# EAGLE design TPS61169_HPLED (EAGLE 6.5.0)
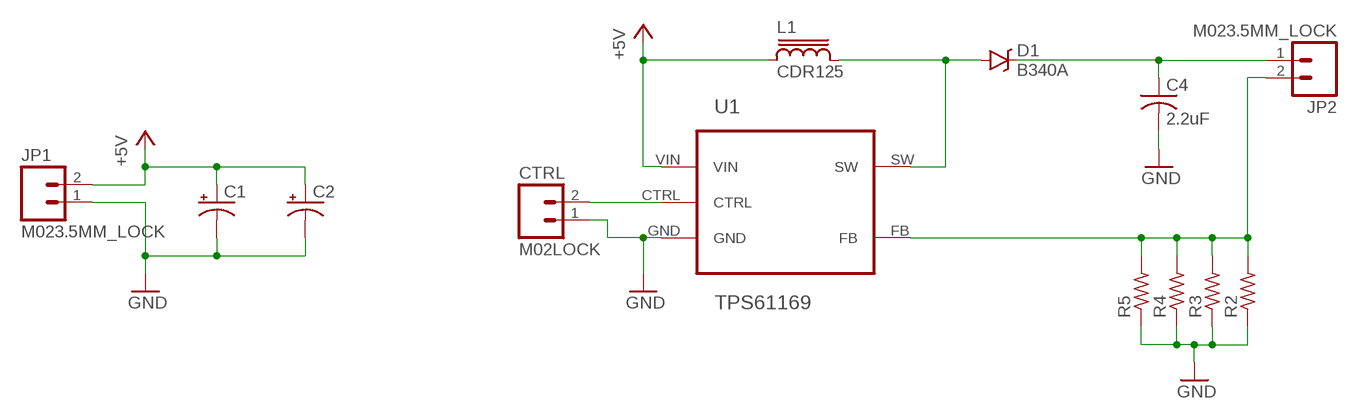
[diagram p0: schematic, sheet 1]

## Parts
C1  CPOL-USE3.5-8  [E3,5-8]
C2  CPOL-USE3.5-8  [E3,5-8]
C4  2.2uF  C-USC0805  [C0805]
CTRL  M02LOCK  [1X02_LOCK]
D1  B340A  DIODE-SCHOTTKY-B340A  [SMA-DIODE]
JP1  M023.5MM_LOCK  [SCREWTERMINAL-3.5MM-2_LOCK]
JP2  M023.5MM_LOCK  [SCREWTERMINAL-3.5MM-2_LOCK]
L1  CDR125  [CDR125]
R2  R-US_R0805  [R0805]
R3  R-US_R0805  [R0805]
R4  R-US_R0805  [R0805]
R5  R-US_R0805  [R0805]
U1  TPS61169  74AHCT1G04GW/T1  [SOT65P210X110-5N]

## Nets
+5V: C1.+ C2.+ JP1.2 L1.1 U1.VIN
GND: C1.- C2.- C4.2 CTRL.1 JP1.1 R2.1 R3.1 R4.1 R5.1 U1.GND
N$1: CTRL.2 U1.CTRL
N$2: D1.A L1.2 U1.SW
N$3: JP2.2 R2.2 R3.2 R4.2 R5.2 U1.FB
N$4: C4.1 D1.C JP2.1

## Library data of the parts
C1 C2 = rcl:CPOL-US: POLARIZED CAPACITOR, American symbol
C4 = rcl:C-US: CAPACITOR, American symbol
CTRL JP1 JP2 = SparkFun-Connectors:M02: Standard 2-pin 0.1" header. Use with - straight break away headers ( PRT-00116) - right angle break away headers (PRT-00553) - swiss pins (PRT-00743) - machine pins (PRT-00117) - female headers (PRT-00115) Molex polarized connector foot print use with: PRT-08233 with associated crimp pins and housings. 2.54_SCREWTERM for use with PRT-10571. 3.5mm Screw Terminal footprints for PRT-08084 5mm Screw Terminal footprints for use with PRT-08432
D1 = SparkFun-DiscreteSemi:DIODE-SCHOTTKY: Schottky diodes in SFE's production catalog BAT20J 1A 23V 0.62Vf RB751 120mA 40V 0.37Vf PMEG4005EJ 0.5A 40V 0.42Vf MBRA140 1A 40V 0.5Vf B340A 3A 40V SMA; PROD_ID: DIO-09886
L1 = inductor-sumida:CDR125: Power Inductor
R2-R5 = rcl:R-US_: RESISTOR, American symbol
U1 = TPS61169:74AHCT1G04GW/T1: Inverter; MPN: 74AHCT1G04GW/T1; OC_FARNELL: 1085245; OC_NEWARK: 99K0509; PACKAGE: SOT353-1-5; SUPPLIER: NXP

## Board
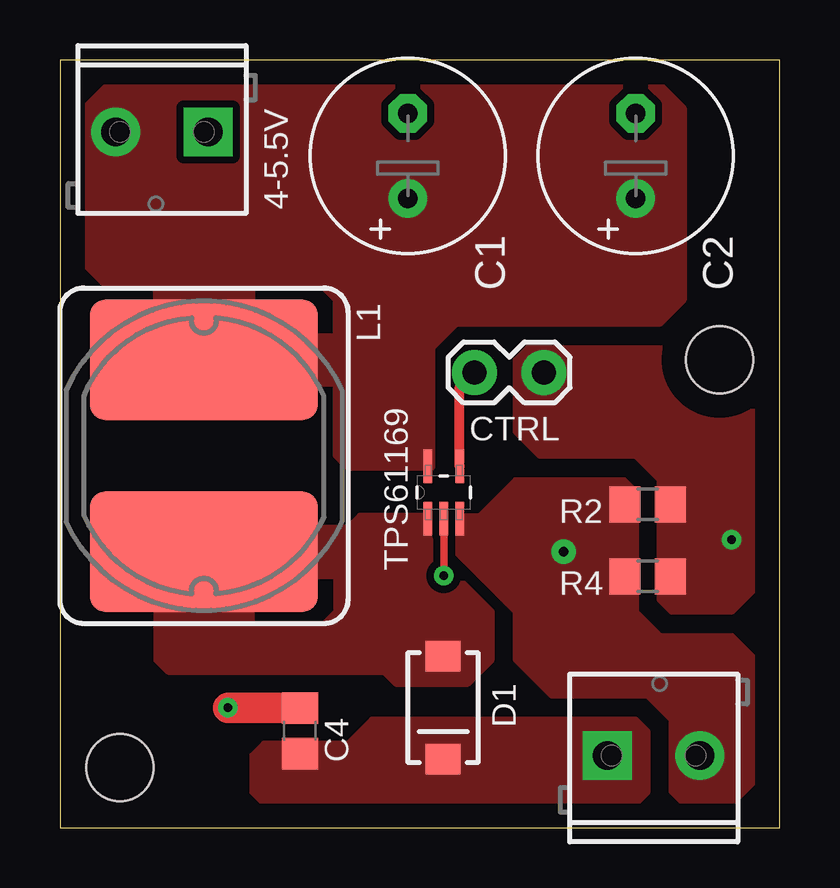
[diagram p1: board, top side]
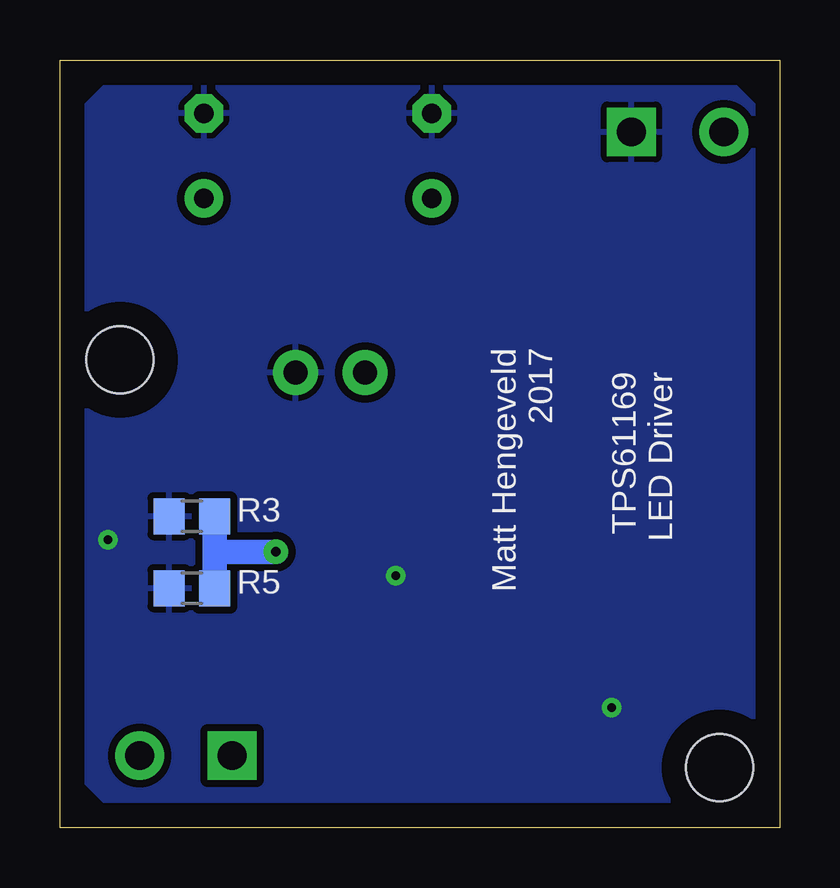
[diagram p2: board, bottom side, seen from below]

Size 30 x 32 mm. Coordinates in mm from the lower left corner, seen from the top.
Outline: 0,0 30,0 30,32 0,32 0,0
Copper layers (1*16): Top 0.035mm / dielectric 1.5mm / Bottom 0.035mm
Design rules "default *": minimum track width 10mil, minimum drill 24mil, track to track 8mil, track to pad 8mil, pad to pad 8mil, via to via 8mil, smd to smd 8mil, copper to edge 40mil, drill to drill 8mil, minimum pad ring 10mil, minimum via ring 8mil, stop-mask expansion 4mil, vias tented up to drill 0mil, thermal gap 10mil
Holes 2.8 mm at 2.5,2.5 27.5,19.5

### Footprints (pad centres in the part's own frame; a part is rotated, then mirrored left to right if it is on the bottom)
E3,5-8 = drill 0.813 pad 1.6: + -1.778,0 | drill 0.813 pad 1.6 octagon: - 1.778,0
C0805 = smd 1.3 x 1.5: 1 -0.95,0; 2 0.95,0
1X02_LOCK = drill 1.016 pad 1.88: 1 -0.178,0; 2 2.718,0
SMA-DIODE = smd 1.27 x 1.47: A -2.15,0; C 2.15,0
SCREWTERMINAL-3.5MM-2_LOCK = drill 1.2 pad 2.032 square: 1 -0.178,0 | drill 1.2 pad 2.032: 2 3.678,0
CDR125 = smd 5 x 9.5: 1 -4,0; 2 4,0
R0805 = smd 1.3 x 1.5: 1 -0.95,0; 2 0.95,0
SOT65P210X110-5N = smd 1.397 x 0.356: CTRL 1.092,-0.66; FB -1.092,-0.66; GND -1.092,0; SW -1.092,0.66; VIN 1.092,0.66

### Placement (x,y rotation side)
C1  14.5,28 90 top
C2  24,28 90 top
C4  10,4.03 90 top
CTRL  20,18.97 180 top
D1  15.97,5 270 top
JP1  6,29 180 top
JP2  23,3 0 top
L1  6,15.5 270 top
R2  24.5,13.47 180 top
R3  24.5,12.97 0 bottom
R4  24.5,10.47 180 top
R5  24.5,9.97 0 bottom
U1  16,13.97 90 top

### Tracks (layer width: path | path; a pad name or v marks a point on that pad's centre or on a via)
+5V
  pour Top (isolate 0.305, no thermals): 2,31 25,31 26,30 26,22 25,21 16.5,21 15.5,20 15.5,15 12,15 11.5,15.5 11.5,18.5 10.5,18.5 10.5,20.5 11.5,20.5 11.5,22 11,22.5 8,22.5 8,21.5 4,21.5 4,22.5 2,22.5 1,23.5 1,30
GND  (via drill 0.35 pad 0.81)
  Top 0.305: U1.GND v16,10.5
  Top 1.27: C4.2 7,4.98 v7,5
  other vias: 28,12
  pour Bottom (isolate 0.305): 28,31 2,31 1,30 1,4 4,1 28,1 29,2 29,30
  pour Top (isolate 0.305, no thermals): 29,10 28,9 25.5,9 25,9.5 25,14.5 24,15.5 20,15.5 19,16.5 19,19.5 19.5,20 28,20 29,19
N$1
  Top 0.406: U1.CTRL 16.66,18.35 CTRL.2
N$2
  pour Top (isolate 0.305, no thermals): 4,7 4.5,6.5 13.5,6.5 14,6 17,6 18,7 18,9 15.5,11.5 15.5,13 12.5,13 12,12.5 10,12.5 10,10.5 11.5,10.5 11.5,9 11,8.5 8,8.5 8,10 4,10
N$3  (via drill 0.4 pad 1.02)
  Bottom 1.016: R3.2 23.55,11.5 | 23.55,11.5 R5.2 | v21,11.5 23.55,11.5
  pour Top (isolate 0.305, no thermals): 23.5,14.5 24,14 24,9 25,8 28,8 29,7 29,2 28,1 26,1 25.5,1.5 25.5,4.5 24.5,5.5 20.5,5.5 19,7 19,9 16.5,11.5 16.5,13 17.5,13 19,14.5
N$4
  pour Top (isolate 0.305, no thermals): 24,1 24.5,1.5 24.5,4 24,4.5 13,4.5 12,3.5 8.5,3.5 8,3 8,1.5 8.5,1

### Text on the board
tPlace: 4-5.5V | TPS61169 | D1
bPlace: Matt Hengeveld / 2017 | TPS61169 / LED Driver